# Altium schematic sheet CPU.schdoc
size 743 x 472 mm
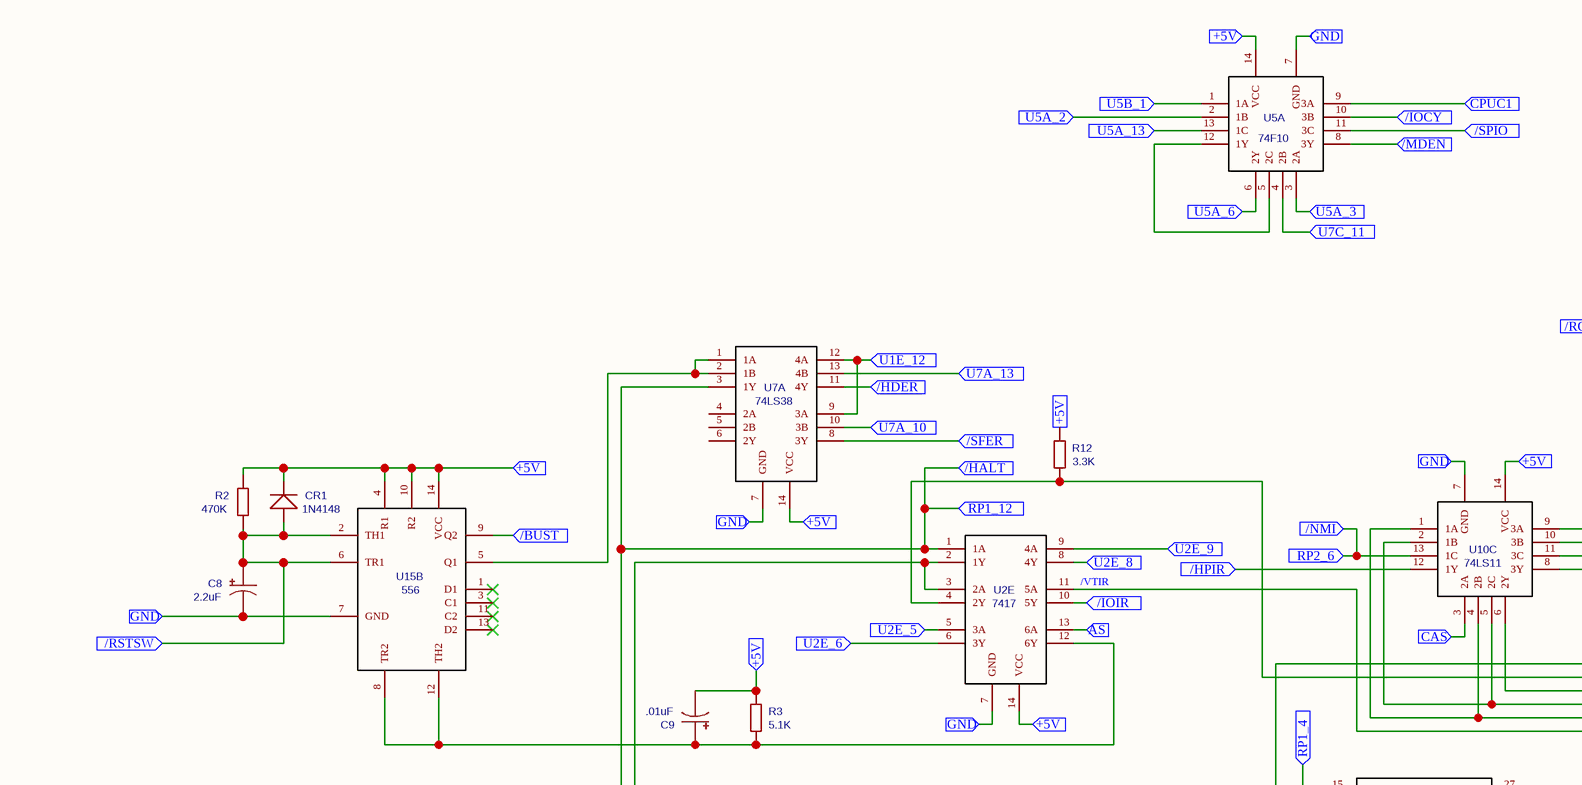
[diagram p0: CPU.schdoc, top left]
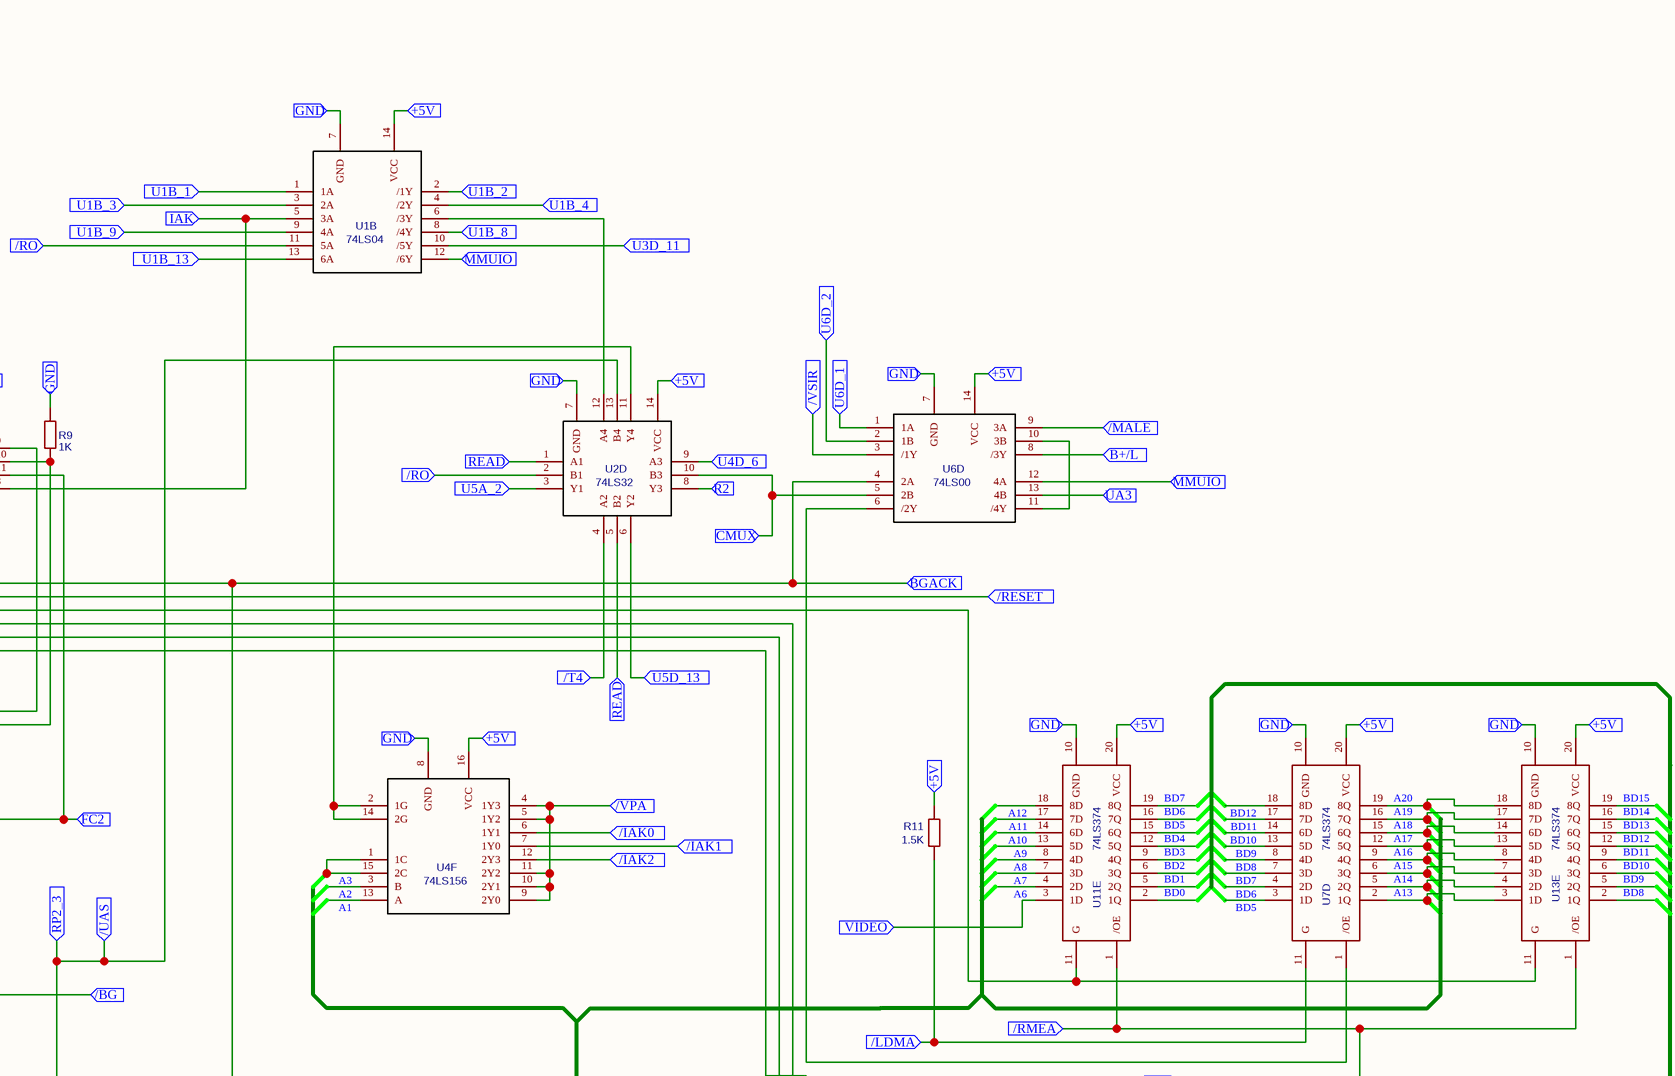
[diagram p1: CPU.schdoc, top middle]
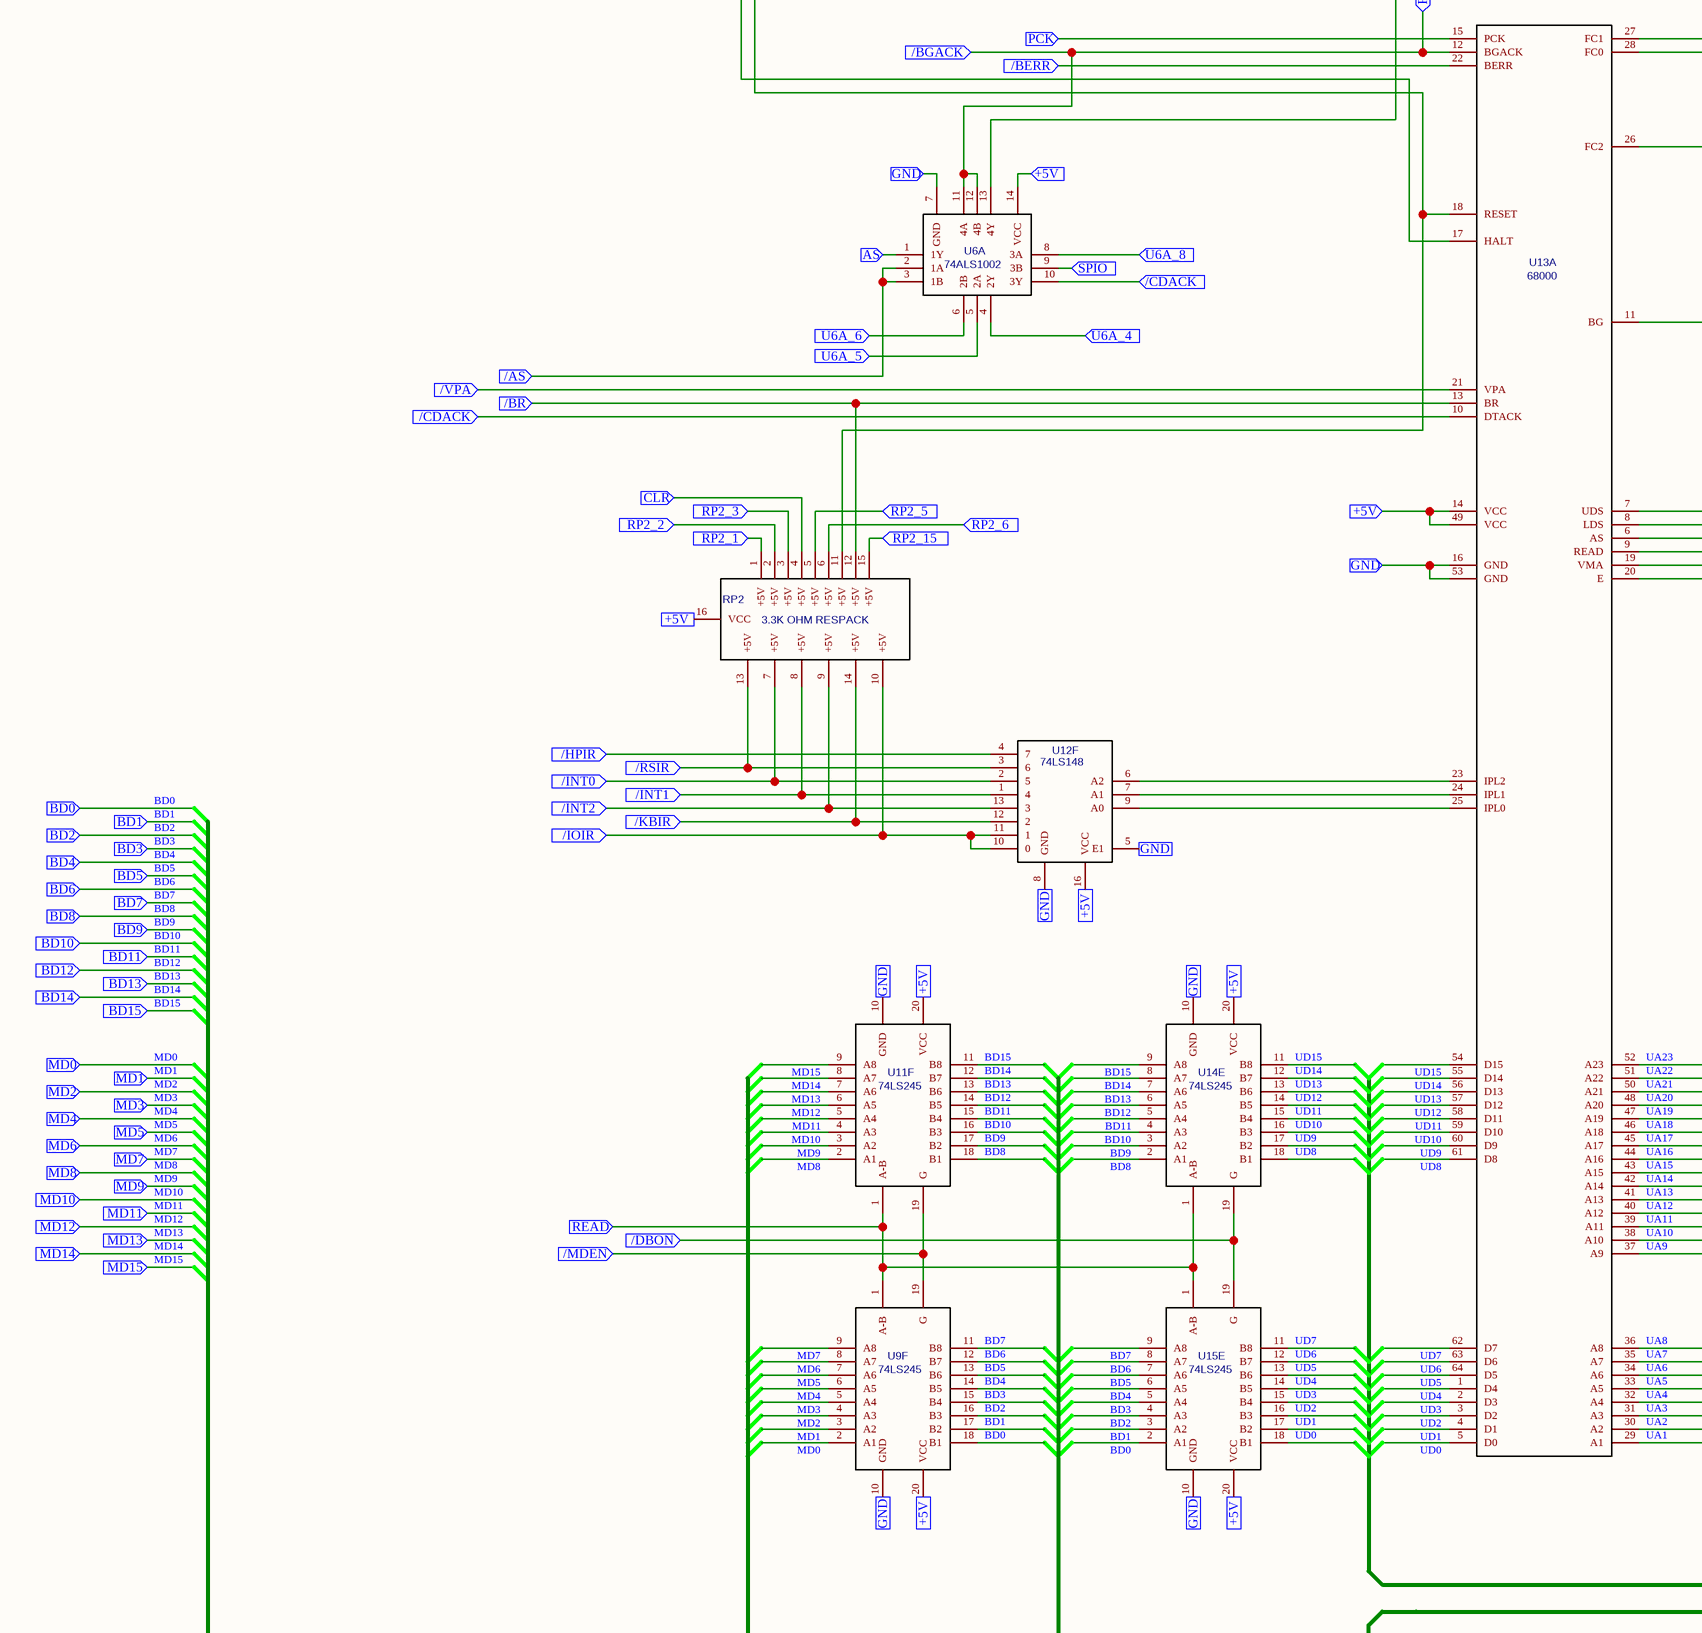
[diagram p2: CPU.schdoc, bottom left]
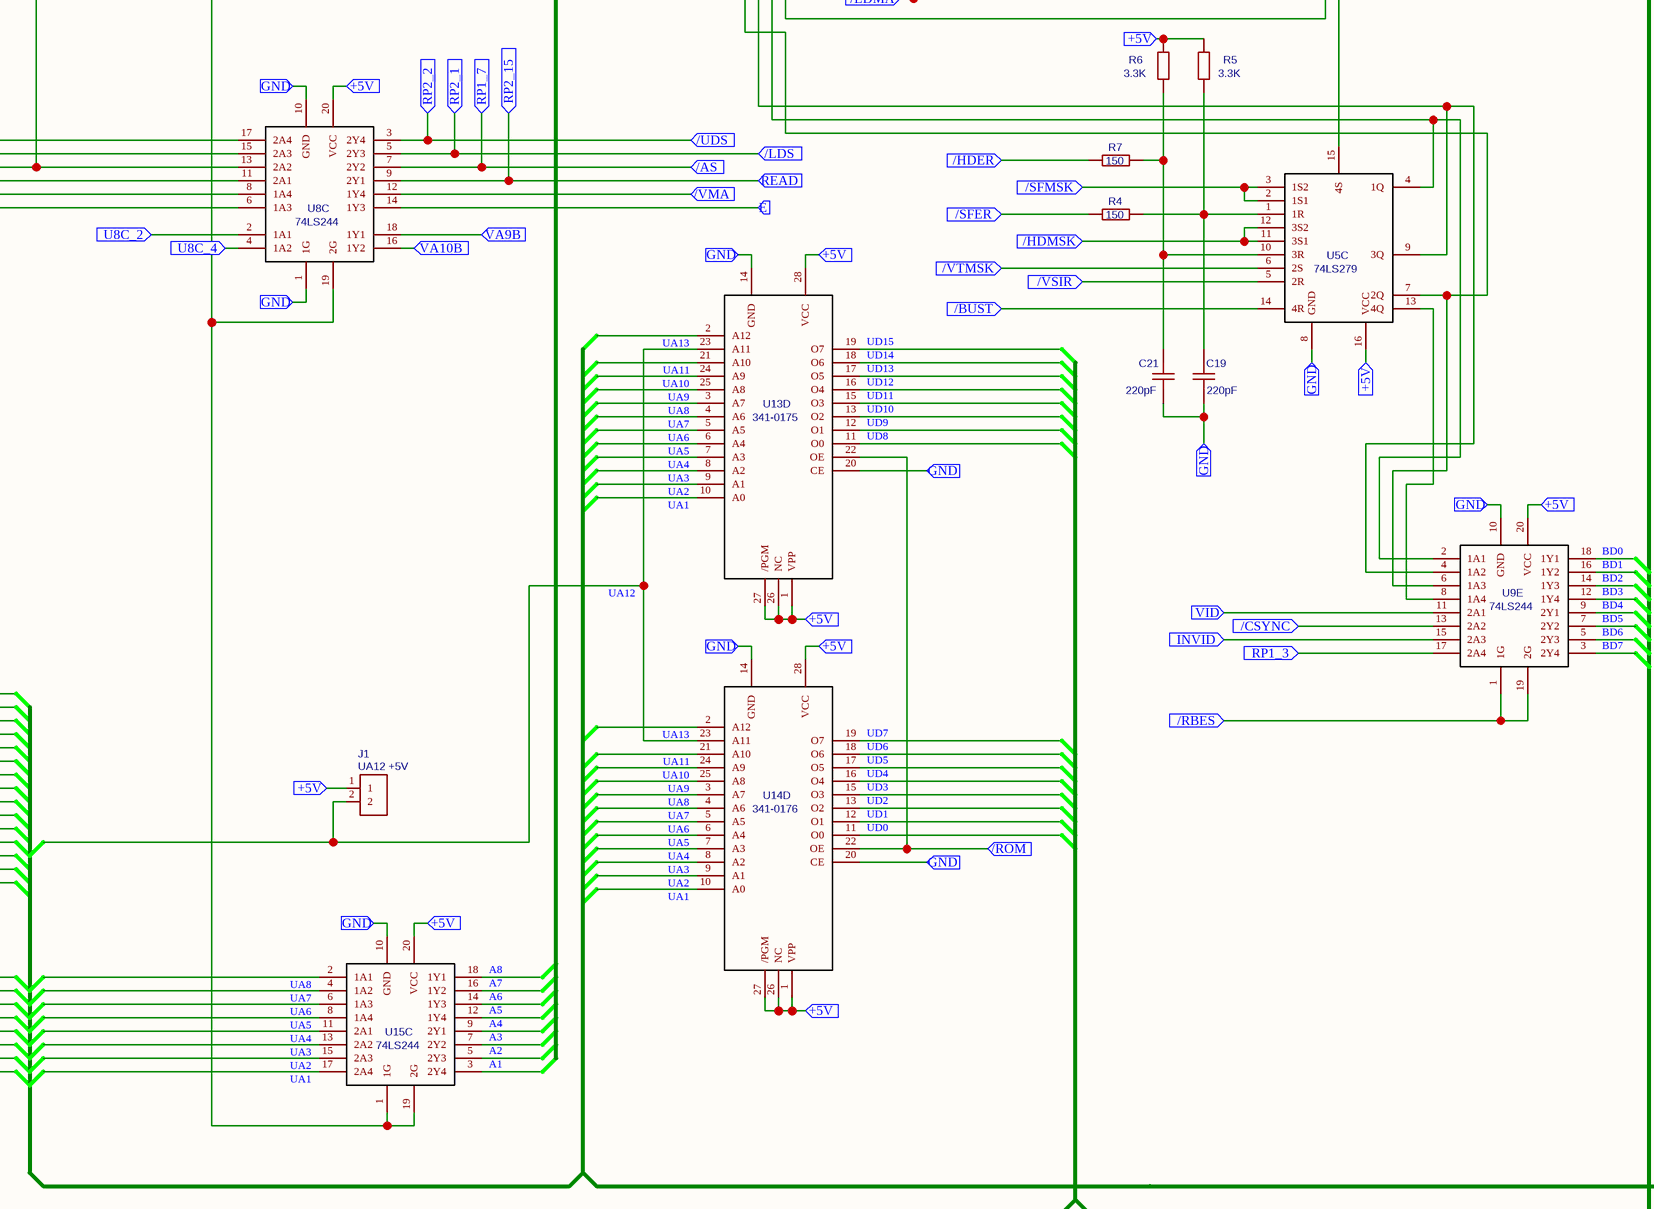
[diagram p3: CPU.schdoc, bottom middle]
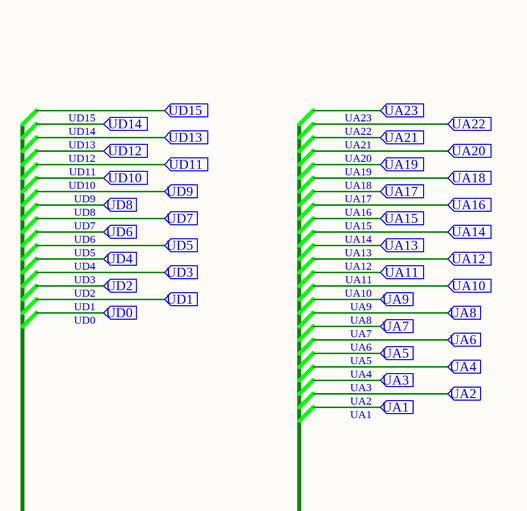
[diagram p4: CPU.schdoc, bottom right]

## Parts
C8  2.2uF  [LISA_CPU_AXIAL_CAP]
C9  .01uF  [LISA_RESISTOR]
C19  220pF  [LISA_DISC_CERAMIC_CAPACITOR]
C21  220pF  [LISA_DISC_CERAMIC_CAPACITOR]
CR1  1N4148  [LISA_CPU_DIODE]
J1  UA12 +5V  [HDR-TH_2P-P2.54-V-M-1]
R2  470K  [LISA_RESISTOR]
R3  5.1K  [LISA_RESISTOR]
R4  150  [LISA_RESISTOR]
R5  3.3K  [LISA_RESISTOR]
R6  3.3K  [LISA_RESISTOR]
R7  150  [LISA_RESISTOR]
R9  1K  [LISA_RESISTOR]
R11  1.5K  [LISA_RESISTOR]
R12  3.3K  [LISA_RESISTOR]
RP2  3.3K OHM RESPACK  [LISA_DIP_16]
U1B  74LS04  [LISA_DIP_14]
U2D  74LS32  [LISA_DIP_14]
U2E  7417  [LISA_DIP_14]
U4F  74LS156  [LISA_DIP_16]
U5A  74F10  [LISA_DIP_14]
U5C  74LS279  [LISA_DIP_16]
U6A  74ALS1002  [LISA_DIP_14]
U6D  74LS00  [LISA_DIP_14]
U7A  74LS38  [LISA_DIP_14]
U7D  74LS374  [LISA_DIP_20]
U8C  74LS244  [LISA_DIP_20]
U9E  74LS244  [LISA_DIP_20]
U9F  74LS245  [LISA_DIP_20]
U10C  74LS11  [LISA_DIP_14]
U11E  74LS374  [LISA_DIP_20]
U11F  74LS245  [LISA_DIP_20]
U12F  74LS148  [LISA_DIP_16]
U13A  68000  [68000_LISA]
U13D  341-0175  [LISA_CPU_2764_EPROM]
U13E  74LS374  [LISA_DIP_20]
U14D  341-0176  [LISA_CPU_2764_EPROM]
U14E  74LS245  [LISA_DIP_20]
U15B  556  [LISA_DIP_14]
U15C  74LS244  [LISA_DIP_20]
U15E  74LS245  [LISA_DIP_20]

## Ports
+5V (in), /AS (in), /BERR (in), /BG (in), /BGACK (in), /BR (in), /BUST (in), /CDACK (in), /CSYNC (in), /DBON (in), /HALT (in), /HDER (in), /HDMSK (in), /HPIR (in), /IAK0 (in), /IAK1 (in), /IAK2 (in), /INT0 (in), /INT1 (in), /INT2 (in), /IOCY (in), /IOIR (in), /KBIR (in), /LDMA (in), /LDS (in), /MALE (in), /MDEN (in), /NMI (in), /RBES (in), /RESET (in), /RMEA (in), /RO (in), /ROM (in), /RSIR (in), /RSTSW (in), /SFER (in), /SFMSK (in), /SPIO (in), /T4 (in), /UAS (in), /UDS (in), /VMA (in), /VPA (in), /VSIR (in), /VTMSK (in), AS (in), B+/L (in), BD0 (in), BD1 (in), BD2 (in), BD3 (in), BD4 (in), BD5 (in), BD6 (in), BD7 (in), BD8 (in), BD9 (in), BD10 (in), BD11 (in), BD12 (in), BD13 (in), BD14 (in), BD15 (in), BGACK (in), CAS (in), CLR (in), CMUX (in), CPUC1 (in), E (in), FC2 (in), GND (in), IAK (in), INVID (in), MD0 (in), MD1 (in), MD2 (in), MD3 (in), MD4 (in), MD5 (in), MD6 (in), MD7 (in), MD8 (in), MD9 (in), MD10 (in), MD11 (in), MD12 (in), MD13 (in), MD14 (in), MD15 (in), MMUIO (in), PCK (in), R2 (in), READ (in), RP1_3 (in), RP1_4 (in), RP1_7 (in), RP1_12 (in), RP2_1 (in), RP2_2 (in), RP2_3 (in), RP2_5 (in), RP2_6 (in), RP2_15 (in), SPIO (in), U1B_1 (in), U1B_2 (in), U1B_3 (in), U1B_4 (in), U1B_8 (in), U1B_9 (in), U1B_13 (in), U1E_12 (in), U2E_5 (in), U2E_6 (in), U2E_8 (in), U2E_9 (in), U3D_11 (in), U4D_6 (in), U5A_2 (in), U5A_3 (in), U5A_6 (in), U5A_13 (in), U5B_1 (in), U5D_13 (in), U6A_4 (in), U6A_5 (in), U6A_6 (in), U6A_8 (in), U6D_1 (in), U6D_2 (in), U7A_10 (in), U7A_13 (in), U7C_11 (in), U8C_2 (in), U8C_4 (in), UA1 (in), UA2 (in), UA3 (in), UA4 (in), UA5 (in), UA6 (in), UA7 (in), UA8 (in), UA9 (in), UA10 (in), UA11 (in), UA12 (in), UA13 (in), UA14 (in), UA15 (in), UA16 (in), UA17 (in), UA18 (in), UA19 (in), UA20 (in), UA21 (in), UA22 (in), UA23 (in), UD0 (in), UD1 (in), UD2 (in), UD3 (in), UD4 (in), UD5 (in), UD6 (in), UD7 (in), UD8 (in), UD9 (in), UD10 (in), UD11 (in), UD12 (in), UD13 (in), UD14 (in), UD15 (in), VA9B (in), VA10B (in), VID (in), VIDEO (in)

## Nets
+5V: C9.2 CR1.2 J1.1 R2.2 R3.2 R5.1 R6.1 R11.1 R12.2 RP2.16(VCC) U1B.14(VCC) U2D.14(VCC) U2E.14(VCC) U4F.16(VCC) U5A.14(VCC) U5C.16(VCC) U6A.14(VCC) U6D.14(VCC) U7A.14(VCC) U7D.20(VCC) U8C.20(VCC) U9E.20(VCC) U9F.20(VCC) U10C.14(VCC) U11E.20(VCC) U11F.20(VCC) U12F.16(VCC) U13A.14(VCC) U13A.49(VCC) U13D.1(VPP) U13D.26(NC) U13D.27(/PGM) U13D.28(VCC) U13E.20(VCC) U14D.1(VPP) U14D.26(NC) U14D.27(/PGM) U14D.28(VCC) U14E.20(VCC) U15B.4(R1) U15B.10(R2) U15B.14(VCC) U15C.20(VCC) U15E.20(VCC) ; port +5V
/AS: U6A.2(1A) U6A.3(1B) U8C.7(2Y2) ; port /AS, port RP1_7
/BERR: U13A.22(BERR) ; port /BERR
/BG: U13A.11(BG) ; port /BG
/BGACK: U6A.11(4A) U6A.12(4B) U13A.12(BGACK) ; port /BGACK, port RP1_4
/BR: RP2.12(+5V) U13A.13(BR) ; port /BR
/BUST: U5C.14(4R) U15B.9(Q2) ; port /BUST
/CDACK: U6A.10(3Y) U13A.10(DTACK) ; port /CDACK
/CSYNC: U9E.13(2A2) ; port /CSYNC
/DBON: U14E.19(G) U15E.19(G) ; port /DBON
/HALT: U2E.1(1A) U7A.3(1Y) U13A.17(HALT) ; port RP1_12, port /HALT
/HDER: R7.1 U7A.11(4Y) ; port /HDER
/HDMSK: U5C.11(3S1) U5C.12(3S2) ; port /HDMSK
/HPIR: U10C.12(1Y) U12F.4(7) ; port /HPIR
/IAK0: U4F.6(1Y1) ; port /IAK0
/IAK1: U4F.7(1Y0) ; port /IAK1
/IAK2: U4F.12(2Y3) ; port /IAK2
/INT0: RP2.7(+5V) U12F.2(5) ; port /INT0
/INT1: RP2.8(+5V) U12F.1(4) ; port /INT1
/INT2: RP2.9(+5V) U12F.13(3) ; port /INT2
/IOCY: U5A.10(3B) ; port /IOCY
/IOIR: RP2.10(+5V) U2E.10(5Y) U12F.10(0) U12F.11(1) ; port /IOIR
/KBIR: RP2.14(+5V) U12F.12(2) ; port /KBIR
/LDMA: R11.2 U7D.11(G) ; port /LDMA
/LDS: RP2.1(+5V) U8C.5(2Y3) ; port /LDS, port RP2_1
/MALE: U6D.9(3A) ; port /MALE
/MDEN: U5A.8(3Y) U9F.19(G) U11F.19(G) ; port /MDEN
/NMI: RP2.6(+5V) U10C.13(1C) ; port RP2_6, port /NMI
/RBES: U9E.1(1G) U9E.19(2G) ; port /RBES
/RESET: R12.1 U2E.4(2Y) ; port /RESET
/RMEA: U5C.15(4S) U11E.1(/OE) U13E.1(/OE) ; port /RMEA
/RO: U1B.11(5A) U2D.2(B1) ; port /RO
/ROM: U13D.22(OE) U14D.22(OE) ; port /ROM
/RSIR: RP2.13(+5V) U12F.3(6) ; port /RSIR
/RSTSW: C8.1 CR1.1 R2.1 U15B.2(TH1) U15B.6(TR1) ; port /RSTSW
/SFER: R4.1 U7A.8(3Y) ; port /SFER
/SFMSK: U5C.2(1S1) U5C.3(1S2) ; port /SFMSK
/SPIO: U5A.11(3C) ; port /SPIO
/T4: U2D.4(A2) ; port /T4
/UAS: RP2.3(+5V) U2D.13(B4) U8C.13(2A2) U13A.6(AS) ; port RP2_3, port /UAS
/UDS: RP2.2(+5V) U8C.3(2Y4) ; port /UDS, port RP2_2
/VMA: U8C.12(1Y4) ; port /VMA
/VPA: U4F.4(1Y3) U4F.5(1Y2) U4F.9(2Y0) U4F.10(2Y1) U4F.11(2Y2) U13A.21(VPA) ; port /VPA
/VSIR: U5C.5(2R) U6D.3(/1Y) ; port /VSIR
/VTIR: U2E.11(5A) U5C.7(2Q) U9E.6(1A3)
/VTMSK: U5C.6(2S) ; port /VTMSK
A1: U4F.13(A) U15C.3(2Y4)
A2: U4F.3(B) U15C.5(2Y3)
A3: U4F.1(1C) U4F.15(2C) U15C.7(2Y2)
A4: U15C.9(2Y1)
A5: U15C.12(1Y4)
A6: U11E.4(2D) U15C.14(1Y3)
A7: U11E.7(3D) U15C.16(1Y2)
A8: U11E.8(4D) U15C.18(1Y1)
A9: U11E.13(5D)
A10: U11E.14(6D)
A11: U11E.17(7D)
A12: U11E.18(8D)
A13: U7D.2(1Q) U13E.3(1D)
A14: U7D.5(2Q) U13E.4(2D)
A15: U7D.6(3Q) U13E.7(3D)
A16: U7D.9(4Q) U13E.8(4D)
A17: U7D.12(5Q) U13E.13(5D)
A18: U7D.15(6Q) U13E.14(6D)
A19: U7D.16(7Q) U13E.17(7D)
A20: U7D.19(8Q) U13E.18(8D)
AS: U2E.13(6A) U6A.1(1Y) ; port AS
B+/L: U6D.8(/3Y) ; port B+/L
BD0: U9E.18(1Y1) U9F.18(B1) U11E.2(1Q) U15E.2(A1) ; port BD0
BD1: U9E.16(1Y2) U9F.17(B2) U11E.5(2Q) U15E.3(A2) ; port BD1
BD2: U9E.14(1Y3) U9F.16(B3) U11E.6(3Q) U15E.4(A3) ; port BD2
BD3: U9E.12(1Y4) U9F.15(B4) U11E.9(4Q) U15E.5(A4) ; port BD3
BD4: U9E.9(2Y1) U9F.14(B5) U11E.12(5Q) U15E.6(A5) ; port BD4
BD5: U7D.3(1D) U9E.7(2Y2) U9F.13(B6) U11E.15(6Q) U15E.7(A6) ; port BD5
BD6: U7D.4(2D) U9E.5(2Y3) U9F.12(B7) U11E.16(7Q) U15E.8(A7) ; port BD6
BD7: U7D.7(3D) U9E.3(2Y4) U9F.11(B8) U11E.19(8Q) U15E.9(A8) ; port BD7
BD8: U7D.8(4D) U11F.18(B1) U13E.2(1Q) U14E.2(A1) ; port BD8
BD9: U7D.13(5D) U11F.17(B2) U13E.5(2Q) U14E.3(A2) ; port BD9
BD10: U7D.14(6D) U11F.16(B3) U13E.6(3Q) U14E.4(A3) ; port BD10
BD11: U7D.17(7D) U11F.15(B4) U13E.9(4Q) U14E.5(A4) ; port BD11
BD12: U7D.18(8D) U11F.14(B5) U13E.12(5Q) U14E.6(A5) ; port BD12
BD13: U11F.13(B6) U13E.15(6Q) U14E.7(A6) ; port BD13
BD14: U11F.12(B7) U13E.16(7Q) U14E.8(A7) ; port BD14
BD15: U11F.11(B8) U13E.19(8Q) U14E.9(A8) ; port BD15
BGACK: U6A.13(4Y) U6D.4(2A) U8C.19(2G) U15C.1(1G) U15C.19(2G) ; port BGACK
CAS: U10C.3(2A) ; port CAS
CLR: RP2.4(+5V) ; port CLR
CMUX: U2D.10(B3) U6D.5(2B) ; port CMUX
CPUC1: U5A.9(3A) ; port CPUC1
E: U8C.14(1Y3) ; port E
FC2: U10C.11(3C) U13A.26(FC2) ; port FC2
GND: C8.2 C19.1 C21.1 R9.1 U1B.7(GND) U2D.7(GND) U2E.7(GND) U4F.8(GND) U5A.7(GND) U5C.8(GND) U6A.7(GND) U6D.7(GND) U7A.7(GND) U7D.10(GND) U8C.1(1G) U8C.10(GND) U9E.10(GND) U9F.10(GND) U10C.7(GND) U11E.10(GND) U11F.10(GND) U12F.5(E1) U12F.8(GND) U13A.16(GND) U13A.53(GND) U13D.14(GND) U13D.20(CE) U13E.10(GND) U14D.14(GND) U14D.20(CE) U14E.10(GND) U15B.7(GND) U15C.10(GND) U15E.10(GND) ; port GND
IAK: U1B.5(3A) U10C.8(3Y) ; port IAK
INVID: U9E.15(2A3) ; port INVID
MD0: U9F.2(A1) ; port MD0
MD1: U9F.3(A2) ; port MD1
MD2: U9F.4(A3) ; port MD2
MD3: U9F.5(A4) ; port MD3
MD4: U9F.6(A5) ; port MD4
MD5: U9F.7(A6) ; port MD5
MD6: U9F.8(A7) ; port MD6
MD7: U9F.9(A8) ; port MD7
MD8: U11F.2(A1) ; port MD8
MD9: U11F.3(A2) ; port MD9
MD10: U11F.4(A3) ; port MD10
MD11: U11F.5(A4) ; port MD11
MD12: U11F.6(A5) ; port MD12
MD13: U11F.7(A6) ; port MD13
MD14: U11F.8(A7) ; port MD14
MD15: U11F.9(A8) ; port MD15
MMUIO: U1B.12(/6Y) U6D.12(4A) ; port MMUIO
PCK: U13A.15(PCK) ; port PCK
R2: U2D.8(Y3) ; port R2
READ: RP2.15(+5V) U2D.1(A1) U2D.5(B2) U8C.9(2Y1) U9F.1(A-B) U11F.1(A-B) U14E.1(A-B) U15E.1(A-B) ; port READ, port RP2_15
RP1_3: U9E.17(2A4) ; port RP1_3
RP2_5: RP2.5(+5V) ; port RP2_5
SPIO: U6A.9(3B) ; port SPIO
U1B_1: U1B.1(1A) ; port U1B_1
U1B_2: U1B.2(/1Y) ; port U1B_2
U1B_3: U1B.3(2A) ; port U1B_3
U1B_4: U1B.4(/2Y) ; port U1B_4
U1B_8: U1B.8(/4Y) ; port U1B_8
U1B_9: U1B.9(4A) ; port U1B_9
U1B_13: U1B.13(6A) ; port U1B_13
U1E_12: U7A.9(3A) U7A.12(4A) ; port U1E_12
U2E_5: U2E.5(3A) ; port U2E_5
U2E_6: U2E.6(3Y) ; port U2E_6
U2E_8: U2E.8(4Y) ; port U2E_8
U2E_9: U2E.9(4A) ; port U2E_9
U3D_11: U1B.10(/5Y) ; port U3D_11
U4D_6: U2D.9(A3) ; port U4D_6
U5A_2: U2D.3(Y1) U5A.2(1B) ; port U5A_2
U5A_3: U5A.3(2A) ; port U5A_3
U5A_6: U5A.6(2Y) ; port U5A_6
U5A_13: U5A.13(1C) ; port U5A_13
U5B_1: U5A.1(1A) ; port U5B_1
U5D_13: U2D.6(Y2) ; port U5D_13
U6A_4: U6A.4(2Y) ; port U6A_4
U6A_5: U6A.5(2A) ; port U6A_5
U6A_6: U6A.6(2B) ; port U6A_6
U6A_8: U6A.8(3A) ; port U6A_8
U6D_1: U6D.1(1A) ; port U6D_1
U6D_2: U6D.2(1B) ; port U6D_2
U7A_10: U7A.10(3B) ; port U7A_10
U7A_13: U7A.13(4B) ; port U7A_13
U7C_11: U5A.4(2B) ; port U7C_11
U8C_2: U8C.2(1A1) ; port U8C_2
U8C_4: U8C.4(1A2) ; port U8C_4
UA1: U13A.29(A1) U13D.10(A0) U14D.10(A0) U15C.17(2A4) ; port UA1
UA2: U13A.30(A2) U13D.9(A1) U14D.9(A1) U15C.15(2A3) ; port UA2
UA3: U6D.13(4B) U13A.31(A3) U13D.8(A2) U14D.8(A2) U15C.13(2A2) ; port UA3
UA4: U13A.32(A4) U13D.7(A3) U14D.7(A3) U15C.11(2A1) ; port UA4
UA5: U13A.33(A5) U13D.6(A4) U14D.6(A4) U15C.8(1A4) ; port UA5
UA6: U13A.34(A6) U13D.5(A5) U14D.5(A5) U15C.6(1A3) ; port UA6
UA7: U13A.35(A7) U13D.4(A6) U14D.4(A6) U15C.4(1A2) ; port UA7
UA8: U13A.36(A8) U13D.3(A7) U14D.3(A7) U15C.2(1A1) ; port UA8
UA9: U13A.37(A9) U13D.25(A8) U14D.25(A8) ; port UA9
UA10: U13A.38(A10) U13D.24(A9) U14D.24(A9) ; port UA10
UA11: U13A.39(A11) U13D.21(A10) U14D.21(A10) ; port UA11
UA12: J1.2 U13A.40(A12) U13D.23(A11) U14D.23(A11) ; port UA12
UA13: U13A.41(A13) U13D.2(A12) U14D.2(A12) ; port UA13
UA14: U13A.42(A14) ; port UA14
UA15: U13A.43(A15) ; port UA15
UA16: U13A.44(A16) ; port UA16
UA17: U13A.45(A17) ; port UA17
UA18: U13A.46(A18) ; port UA18
UA19: U13A.47(A19) ; port UA19
UA20: U13A.48(A20) ; port UA20
UA21: U13A.50(A21) ; port UA21
UA22: U13A.51(A22) ; port UA22
UA23: U13A.52(A23) ; port UA23
UD0: U13A.5(D0) U14D.11(O0) U15E.18(B1) ; port UD0
UD1: U13A.4(D1) U14D.12(O1) U15E.17(B2) ; port UD1
UD2: U13A.3(D2) U14D.13(O2) U15E.16(B3) ; port UD2
UD3: U13A.2(D3) U14D.15(O3) U15E.15(B4) ; port UD3
UD4: U13A.1(D4) U14D.16(O4) U15E.14(B5) ; port UD4
UD5: U13A.64(D5) U14D.17(O5) U15E.13(B6) ; port UD5
UD6: U13A.63(D6) U14D.18(O6) U15E.12(B7) ; port UD6
UD7: U13A.62(D7) U14D.19(O7) U15E.11(B8) ; port UD7
UD8: U13A.61(D8) U13D.11(O0) U14E.18(B1) ; port UD8
UD9: U13A.60(D9) U13D.12(O1) U14E.17(B2) ; port UD9
UD10: U13A.59(D10) U13D.13(O2) U14E.16(B3) ; port UD10
UD11: U13A.58(D11) U13D.15(O3) U14E.15(B4) ; port UD11
UD12: U13A.57(D12) U13D.16(O4) U14E.14(B5) ; port UD12
UD13: U13A.56(D13) U13D.17(O5) U14E.13(B6) ; port UD13
UD14: U13A.55(D14) U13D.18(O6) U14E.12(B7) ; port UD14
UD15: U13A.54(D15) U13D.19(O7) U14E.11(B8) ; port UD15
VA9B: U8C.18(1Y1) ; port VA9B
VA10B: U8C.16(1Y2) ; port VA10B
VID: U9E.11(2A1) ; port VID
VIDEO: U11E.3(1D) ; port VIDEO
NetC9_1: C9.1 R3.1 U2E.12(6Y) U15B.8(TR2) U15B.12(TH2)
NetC19_2: C19.2 R4.2 R5.2 U5C.1(1R)
NetC21_2: C21.2 R6.2 R7.2 U5C.10(3R)
NetR9_2: R9.2 U10C.10(3B) U13A.28(FC0)
NetRP2_11: RP2.11(+5V) U2E.2(1Y) U2E.3(2A) U13A.18(RESET)
NetU1B_6: U1B.6(/3Y) U2D.12(A4)
NetU2D_11: U2D.11(Y4) U4F.2(1G) U4F.14(2G)
NetU5A_5: U5A.5(2C) U5A.12(1Y)
NetU5C_4: U5C.4(1Q) U9E.2(1A1) U10C.2(1B) U10C.5(2C)
NetU5C_9: U5C.9(3Q) U9E.4(1A2) U10C.1(1A) U10C.4(2B)
NetU5C_13: U5C.13(4Q) U9E.8(1A4)
NetU6D_6: U6D.6(/2Y) U7D.1(/OE)
NetU6D_10: U6D.10(3B) U6D.11(/4Y)
NetU7A_1: U7A.1(1A) U7A.2(1B) U15B.5(Q1)
NetU8C_6: U8C.6(1A3) U13A.20(E)
NetU8C_8: U8C.8(1A4) U13A.19(VMA)
NetU8C_11: U8C.11(2A1) U13A.9(READ)
NetU8C_15: U8C.15(2A3) U13A.8(LDS)
NetU8C_17: U8C.17(2A4) U13A.7(UDS)
NetU10C_6: U10C.6(2Y) U11E.11(G) U13E.11(G)
NetU10C_9: U10C.9(3A) U13A.27(FC1)
NetU12F_6: U12F.6(A2) U13A.23(IPL2)
NetU12F_7: U12F.7(A1) U13A.24(IPL1)
NetU12F_9: U12F.9(A0) U13A.25(IPL0)

Not connected (* = marked no-connect by the designer): U7A 4(2A) 5(2B) 6(2Y); U15B 1(D1)* 3(C1)* 11(C2)* 13(D2)*

## Library data of the parts
C8 = 2.2uF: Contributor: William Tooker; spicePre: C; spiceSymbolName: LISA_CPU_AXIAL_CAP
C9 = .01uF: Contributor: William Tooker; spicePre: C; spiceSymbolName: LISA_CPU_AXIAL_CAP
C19 C21 = 220pF: Contributor: William Tooker; spicePre: C; spiceSymbolName: LISA_CPU_CERAMIC_CAP
CR1 = 1N4148: Contributor: William Tooker; spicePre: D; spiceSymbolName: LISA_CPU_DIODE
J1 = UA12 +5V: BOM_Manufacturer: null; BOM_Manufacturer Part: Jumper2; Contributor: William Tooker; BOM_Supplier: LCSC; BOM_Supplier Part: C2940092; BOM_JLCPCB Part Class: Extended Part; spicePre: U; spiceSymbolName: JUMPER2
R2 = 470K: Contributor: William Tooker; spicePre: R; spiceSymbolName: LISA_CPU_RESISTOR
R3 = 5.1K: Contributor: William Tooker; spicePre: R; spiceSymbolName: LISA_CPU_RESISTOR
R4 R7 = 150: Contributor: William Tooker; spicePre: R; spiceSymbolName: LISA_CPU_RESISTOR
R5 R6 R12 = 3.3K: Contributor: William Tooker; spicePre: R; spiceSymbolName: LISA_CPU_RESISTOR
R9 = 1K: Contributor: William Tooker; spicePre: R; spiceSymbolName: LISA_CPU_RESISTOR
R11 = 1.5K: Contributor: William Tooker; spicePre: R; spiceSymbolName: LISA_CPU_RESISTOR
RP2 = 3.3K OHM RESPACK: Contributor: William Tooker; spicePre: R; spiceSymbolName: LISA_CPU_RP2
U1B = 74LS04: Contributor: will_tooker; spicePre: U; spiceSymbolName: LISA_CPU_74LS04
U2D = 74LS32: Contributor: William Tooker; spicePre: U; spiceSymbolName: LISA_CPU_74LS32
U2E = 7417: Contributor: William Tooker; spicePre: U; spiceSymbolName: LISA_CPU_7417
U4F = 74LS156: Contributor: William Tooker; spicePre: U; spiceSymbolName: LISA_CPU_74LS156
U5A = 74F10: Contributor: William Tooker; spicePre: U; spiceSymbolName: LISA_CPU_74F10
U5C = 74LS279: Contributor: William Tooker; spicePre: U; spiceSymbolName: LISA_CPU_74LS279
U6A = 74ALS1002: Contributor: William Tooker; spicePre: U; spiceSymbolName: LISA_CPU_74ALS1002
U6D = 74LS00: Contributor: William Tooker; spicePre: U; spiceSymbolName: LISA_CPU_74LS00
U7A = 74LS38: Contributor: William Tooker; spicePre: U; spiceSymbolName: LISA_CPU_74LS38
U7D U11E U13E = 74LS374: Contributor: William Tooker; spicePre: U; spiceSymbolName: LISA_CPU_74LS374
U8C U9E U15C = 74LS244: Contributor: William Tooker; spicePre: U
  U8C: spiceSymbolName: LISA_CPU_74LS244_CTL
  U9E U15C: spiceSymbolName: LISA_CPU_74LS244
U9F U11F U14E U15E = 74LS245: Contributor: William Tooker; spicePre: U
  U9F U15E: spiceSymbolName: LISA_CPU_74LS245_LOWER
  U11F U14E: spiceSymbolName: LISA_CPU_74LS245_UPPER
U10C = 74LS11: Contributor: William Tooker; spicePre: U; spiceSymbolName: LISA_CPU_74LS11
U12F = 74LS148: Contributor: William Tooker; spicePre: U; spiceSymbolName: LISA_CPU_74LS148
U13A = 68000: Contributor: William Tooker; spicePre: U; spiceSymbolName: 68000 (LISA)
U13D = 341-0175: Contributor: William Tooker; spicePre: U; spiceSymbolName: LISA_CPU_EPROM
U14D = 341-0176: Contributor: William Tooker; spicePre: U; spiceSymbolName: LISA_CPU_EPROM
U15B = 556: Contributor: William Tooker; spicePre: U; spiceSymbolName: LISA_CPU_556